# EAGLE schematic LB1. Expansion Board (EAGLE 9.6.2)
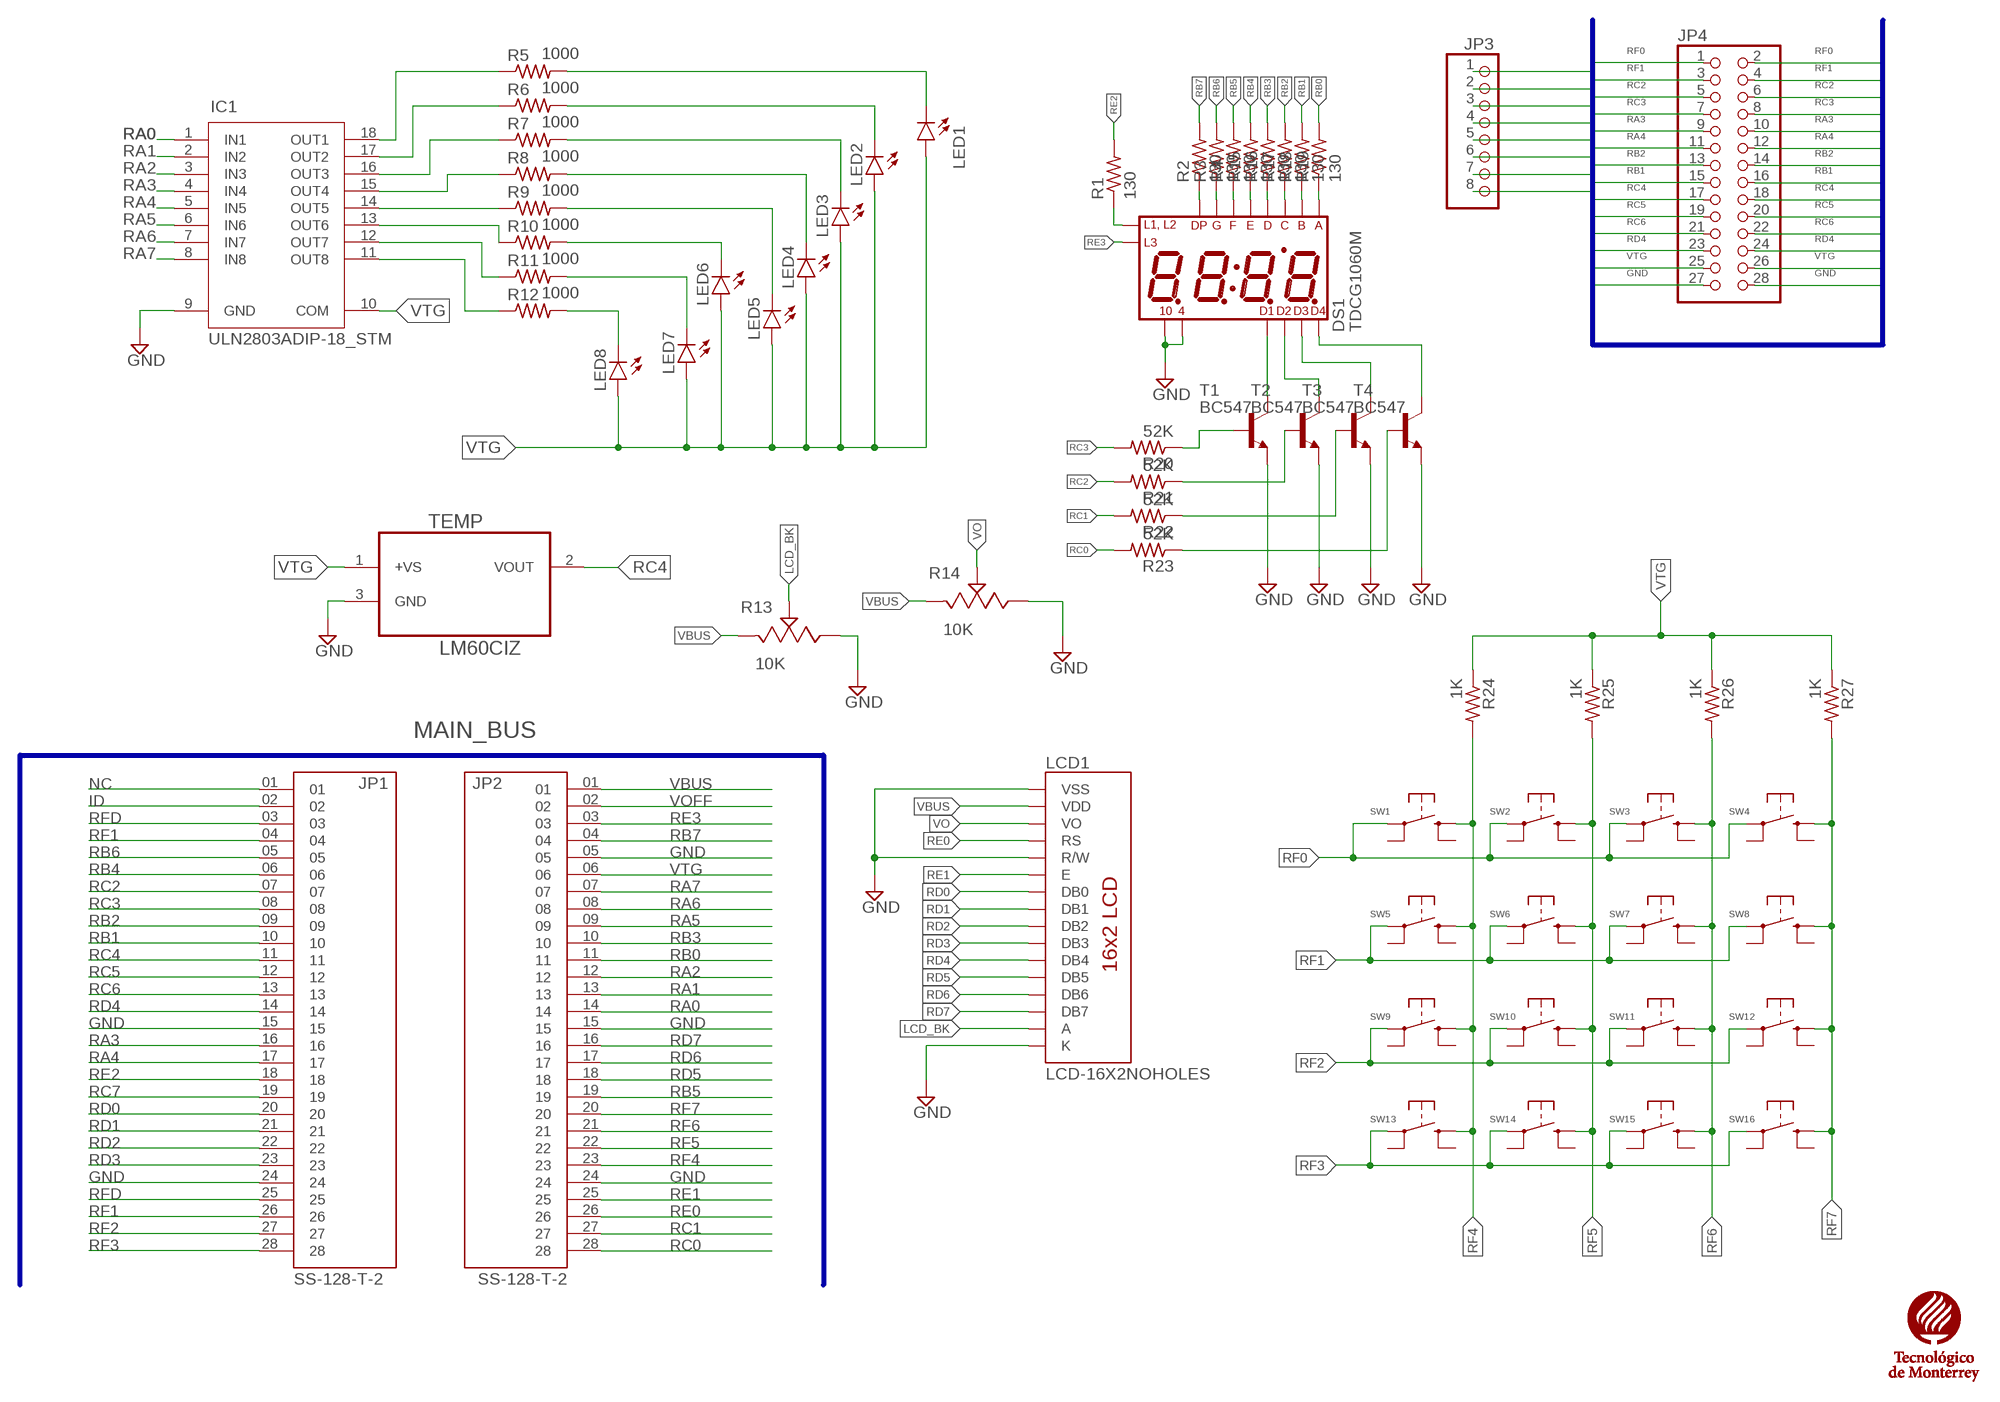
[diagram p0: schematic, sheet 1]

## Parts
DS1  TDCG1060M  [DISPLAY_TDCG1060M]
IC1  ULN2803ADIP-18_STM  [DIP-18_STM]
JP1  SS-128-T-2  [SAMTEC_SS-128-T-2]
JP2  SS-128-T-2  [SAMTEC_SS-128-T-2]
JP3  PINHD-1X8BIG  [1X08-BIG]
JP4  PINHD-2X14-CB  [2X14-BIG]
LCD1  LCD-16X2NOHOLES  [LCD-16X2_NOHOLESNOSILK]
LED1  LED3MM  [LED3MM]
LED2  LED3MM  [LED3MM]
LED3  LED3MM  [LED3MM]
LED4  LED3MM  [LED3MM]
LED5  LED3MM  [LED3MM]
LED6  LED3MM  [LED3MM]
LED7  LED3MM  [LED3MM]
LED8  LED3MM  [LED3MM]
R1  130  R-US  [0207/10]
R2  130  R-US  [0207/10]
R3  130  R-US  [0207/10]
R4  130  R-US  [0207/10]
R5  1000  R-US  [0207/10]
R6  1000  R-US  [0207/10]
R7  1000  R-US  [0207/10]
R8  1000  R-US  [0207/10]
R9  1000  R-US  [0207/10]
R10  1000  R-US  [0207/10]
R11  1000  R-US  [0207/10]
R12  1000  R-US  [0207/10]
R13  10K  3362P-1-103LF  [3362P-1-103LF]
R14  10K  3362P-1-103LF  [3362P-1-103LF]
R15  130  R-US  [0207/10]
R16  130  R-US  [0207/10]
R17  130  R-US  [0207/10]
R18  130  R-US  [0207/10]
R19  130  R-US  [0207/10]
R20  52K  R-US  [0207/10]
R21  52K  R-US  [0207/10]
R22  52K  R-US  [0207/10]
R23  52K  R-US  [0207/10]
R24  1K  R-US  [0207/10]
R25  1K  R-US  [0207/10]
R26  1K  R-US  [0207/10]
R27  1K  R-US  [0207/10]
SW1  1825910-2  [TE_1825910-2]
SW2  1825910-2  [TE_1825910-2]
SW3  1825910-2  [TE_1825910-2]
SW4  1825910-2  [TE_1825910-2]
SW5  1825910-2  [TE_1825910-2]
SW6  1825910-2  [TE_1825910-2]
SW7  1825910-2  [TE_1825910-2]
SW8  1825910-2  [TE_1825910-2]
SW9  1825910-2  [TE_1825910-2]
SW10  1825910-2  [TE_1825910-2]
SW11  1825910-2  [TE_1825910-2]
SW12  1825910-2  [TE_1825910-2]
SW13  1825910-2  [TE_1825910-2]
SW14  1825910-2  [TE_1825910-2]
SW15  1825910-2  [TE_1825910-2]
SW16  1825910-2  [TE_1825910-2]
T1  BC547  [TO92]
T2  BC547  [TO92]
T3  BC547  [TO92]
T4  BC547  [TO92]
TEC1  TEC_LOGO  [TEC_LOGO]
TEMP  LM60CIZ  [TO92/]

## Nets
GND: DS1.4 DS1.10 IC1.9(GND) JP1.15 JP1.24 JP2.05 JP2.15 JP2.24 JP3.1 JP4.27 JP4.28 LCD1.1(VSS) LCD1.5(R/W) LCD1.16(K) R13.3 R14.3 T1.1(E) T2.1(E) T3.1(E) T4.1(E) TEMP.3(GND)
ID: JP1.02
LCD_BK: LCD1.15(A) R13.2
N$1: LED1.K(C) R5.2
N$2: IC1.18(OUT1) R5.1
N$3: IC1.17(OUT2) R6.1
N$4: LED2.K(C) R6.2
N$5: IC1.16(OUT3) R7.1
N$6: IC1.15(OUT4) R8.1
N$7: IC1.14(OUT5) R9.1
N$8: IC1.13(OUT6) R10.1
N$9: IC1.12(OUT7) R11.1
N$10: IC1.11(OUT8) R12.1
N$11: LED3.K(C) R7.2
N$12: LED4.K(C) R8.2
N$13: LED5.K(C) R9.2
N$14: LED6.K(C) R10.2
N$15: LED8.K(C) R12.2
N$16: LED7.K(C) R11.2
N$17: R20.1 T1.2(B)
N$18: LED1.A LED2.A LED3.A LED4.A LED5.A LED6.A LED7.A LED8.A
N$19: DS1.12(L1_L2) R1.1
N$20: DS1.7(DP) R2.1
N$21: DS1.15(G) R3.1
N$22: DS1.11(F) R4.1
N$23: DS1.5(E) R15.1
N$24: DS1.3(D) R16.1
N$25: DS1.13(C) R17.1
N$26: DS1.16(B) R18.1
N$27: DS1.14(A) R19.1
N$28: R21.1 T2.2(B)
N$29: R22.1 T3.2(B)
N$30: R23.1 T4.2(B)
N$31: DS1.1(DIG1) T1.3(C)
N$32: DS1.2(DIG2) T2.3(C)
N$33: DS1.6(DIG3) T3.3(C)
N$34: DS1.8(DIG4) T4.3(C)
NC: JP1.01
RA0: IC1.1(IN1) JP2.14
RA1: IC1.2(IN2) JP2.13
RA2: IC1.3(IN3) JP2.12
RA3: IC1.4(IN4) JP1.16 JP3.2 JP4.9 JP4.10
RA4: IC1.5(IN5) JP1.17 JP3.3 JP4.11 JP4.12
RA5: IC1.6(IN6) JP2.09
RA6: IC1.7(IN7) JP2.08
RA7: IC1.8(IN8) JP2.07
RB0: JP2.11 R19.2
RB1: JP1.10 JP3.4 JP4.15 JP4.16 R18.2
RB2: JP1.09 JP3.5 JP4.13 JP4.14 R17.2
RB3: JP2.10 R16.2
RB4: JP1.06 R15.2
RB5: JP2.19 R4.2
RB6: JP1.05 R3.2
RB7: JP2.04 R2.2
RC0: JP2.28 R23.2
RC1: JP2.27 R22.2
RC2: JP1.07 JP3.6 JP4.5 JP4.6 R21.2
RC3: JP1.08 JP3.7 JP4.7 JP4.8 R20.2
RC4: JP1.11 JP3.8 JP4.17 JP4.18 TEMP.2(VOUT)
RC5: JP1.12 JP4.19 JP4.20
RC6: JP1.13 JP4.21 JP4.22
RC7: JP1.19
RD0: JP1.20 LCD1.7(DB0)
RD1: JP1.21 LCD1.8(DB1)
RD2: JP1.22 LCD1.9(DB2)
RD3: JP1.23 LCD1.10(DB3)
RD4: JP1.14 JP4.23 JP4.24 LCD1.11(DB4)
RD5: JP2.18 LCD1.12(DB5)
RD6: JP2.17 LCD1.13(DB6)
RD7: JP2.16 LCD1.14(DB7)
RE0: JP2.26 LCD1.4(RS)
RE1: JP2.25 LCD1.6(E)
RE2: JP1.18 R1.2
RE3: DS1.9(L3) JP2.03
RF0: JP4.1 JP4.2 SW1.1(P) SW2.1(P) SW3.1(P) SW4.1(P)
RF1: JP1.04 JP1.26 JP4.3 JP4.4 SW5.1(P) SW6.1(P) SW7.1(P) SW8.1(P)
RF2: JP1.27 SW9.1(P) SW10.1(P) SW11.1(P) SW12.1(P)
RF3: JP1.28 SW13.1(P) SW14.1(P) SW15.1(P) SW16.1(P)
RF4: JP2.23 R24.2 SW1.2(S) SW5.2(S) SW9.2(S) SW13.2(S)
RF5: JP2.22 R25.2 SW2.2(S) SW6.2(S) SW10.2(S) SW14.2(S)
RF6: JP2.21 R26.2 SW3.2(S) SW7.2(S) SW11.2(S) SW15.2(S)
RF7: JP2.20 R27.2 SW4.2(S) SW8.2(S) SW12.2(S) SW16.2(S)
RFD: JP1.03 JP1.25
VBUS: JP2.01 LCD1.2(VDD) R13.1 R14.1
VO: LCD1.3(VO) R14.2
VOFF: JP2.02
VTG: IC1.10(COM) JP2.06 JP4.25 JP4.26 R24.1 R25.1 R26.1 R27.1 TEMP.1(+VS)
Unconnected: SW1.3(P1) SW1.4(S1) SW2.3(P1) SW2.4(S1) SW3.3(P1) SW3.4(S1) SW4.3(P1) SW4.4(S1) SW5.3(P1) SW5.4(S1) SW6.3(P1) SW6.4(S1) SW7.3(P1) SW7.4(S1) SW8.3(P1) SW8.4(S1) SW9.3(P1) SW9.4(S1) SW10.3(P1) SW10.4(S1) SW11.3(P1) SW11.4(S1) SW12.3(P1) SW12.4(S1) SW13.3(P1) SW13.4(S1) SW14.3(P1) SW14.4(S1) SW15.3(P1) SW15.4(S1) SW16.3(P1) SW16.4(S1)

## Buses
GND,RA3,RA4,RB1,RB2,RC2,RC3,RC4,RC5,RC6,RD4,RF0,RF1,VTG
MAIN_BUS

## Library data of the parts
DS1 = TE2015_Microcontroladores:TDCG1060M: Clockmodule 10mm Green m.Plex c.c.-E4; DESCRIPTION: Display Modules - LED Character and Numeric Green 7-Segment Clock 4 Character Common Cathode 2V 20mA 0.504 H x 1.583 W x 0.276 D (12.80mm x 40.20mm x 7.00mm) 16-DIP (0.400, 10.16mm); DIGI-KEY_PART_NUMBER: TDCG1060M-ND; MF: Vishay; MP: TDCG1060M; PACKAGE: None; PURCHASE-URL: https://pricing.snapeda.com/search/part/TDCG1060M/?ref=eda
IC1 = TE2015_Microcontroladores:ULN2803A; COPYRIGHT: Copyright (C) 2022 Ultra Librarian. All rights reserved.; DIGI-KEY_PART_NUMBER_1: 497-2356-5-ND; MANUFACTURER_PART_NUMBER: ULN2803A; MFR_NAME: STMicroelectronics
JP1 JP2 = TE2015_Microcontroladores:SS-128-T-2; DESCRIPTION: 28 Position Receptacle Connector 0.100 (2.54mm) Through Hole Gold; DIGI-KEY_PART_NUMBER: SAM1117-28-ND; MF: Samtec; MP: SS-128-T-2; PACKAGE: None; PURCHASE-URL: https://pricing.snapeda.com/search/part/SS-128-T-2/?ref=eda
JP3 = TE2015_Microcontroladores:PINHD-1X8: PIN HEADER
JP4 = TE2015_Microcontroladores:PINHD-2X14: PIN HEADER
LCD1 = TE2015_Microcontroladores:LCD-16X2: Standard text-only 16x2 parallel input LCD Basic 16 character by 2 line display. Typically utilizes the extremely common HD44780 parallel interface chipset SparkFun Products: Basic 16x2 Green <https://www.sparkfun.com/products/255> Basic 8x2 Green <https://www.sparkfun.com/products/11122>; SF_ID: LCD-00255
LED1-LED8 = TE2015_Microcontroladores:LED3MM
R1-R12 R15-R27 = TE2015_Microcontroladores:R-US; SPICEPREFIX: R
R13 R14 = TE2015_Microcontroladores:3362P-1-103LF: TRIMMER 10K OHM 0.5W PC PIN TOP Manufacturer's datasheet <https://www.bourns.com/docs/Product-Datasheets/3362.pdf>; CREATED_PN: PCBLayout.com; DIGIKEY_PN: 3362P-103LF-ND; MANUFACTURER: Bourns Inc.; MPN: 3362P-1-103LF
SW1-SW16 = TE2015_Microcontroladores:1825910-2: SWITCH TACTILE SPST-NO 0.05A 24V Check availability <https://pricing.snapeda.com/parts/1825910-2/TE%20Connectivity/view-part?ref=eda>; AVAILABILITY: In Stock; COMMENT: 1825910-2; CONFIGURATION_POLE-THROW: Single Pole - Single Throw; CONTACT_CURRENT_RATING: 50 mA; DESCRIPTION: 50 mA SPST Round Actuator 160 Gram Force Tactile Pushbutton Switch; EU_ROHS_COMPLIANCE: Compliant; MF: TE Connectivity; MP: 1825910-2; PACKAGE: None; PRICE: None; PURCHASE-URL: https://pricing.snapeda.com/search/part/1825910-2/?ref=eda
T1-T4 = transistor:BC547: NPN TRANSISTOR
TEC1 = TE2015_Microcontroladores:TEC_LOGO
TEMP = TE2015_Microcontroladores:LM60CIZ: IC, TEMPERATURE SENSOR, ± 3°C